# Altium schematic sheet Sheet1.SchDoc: STM32F10C8T6
size A4; DrawnBy: Joseph; SheetNumber: 1; SheetTotal: 1
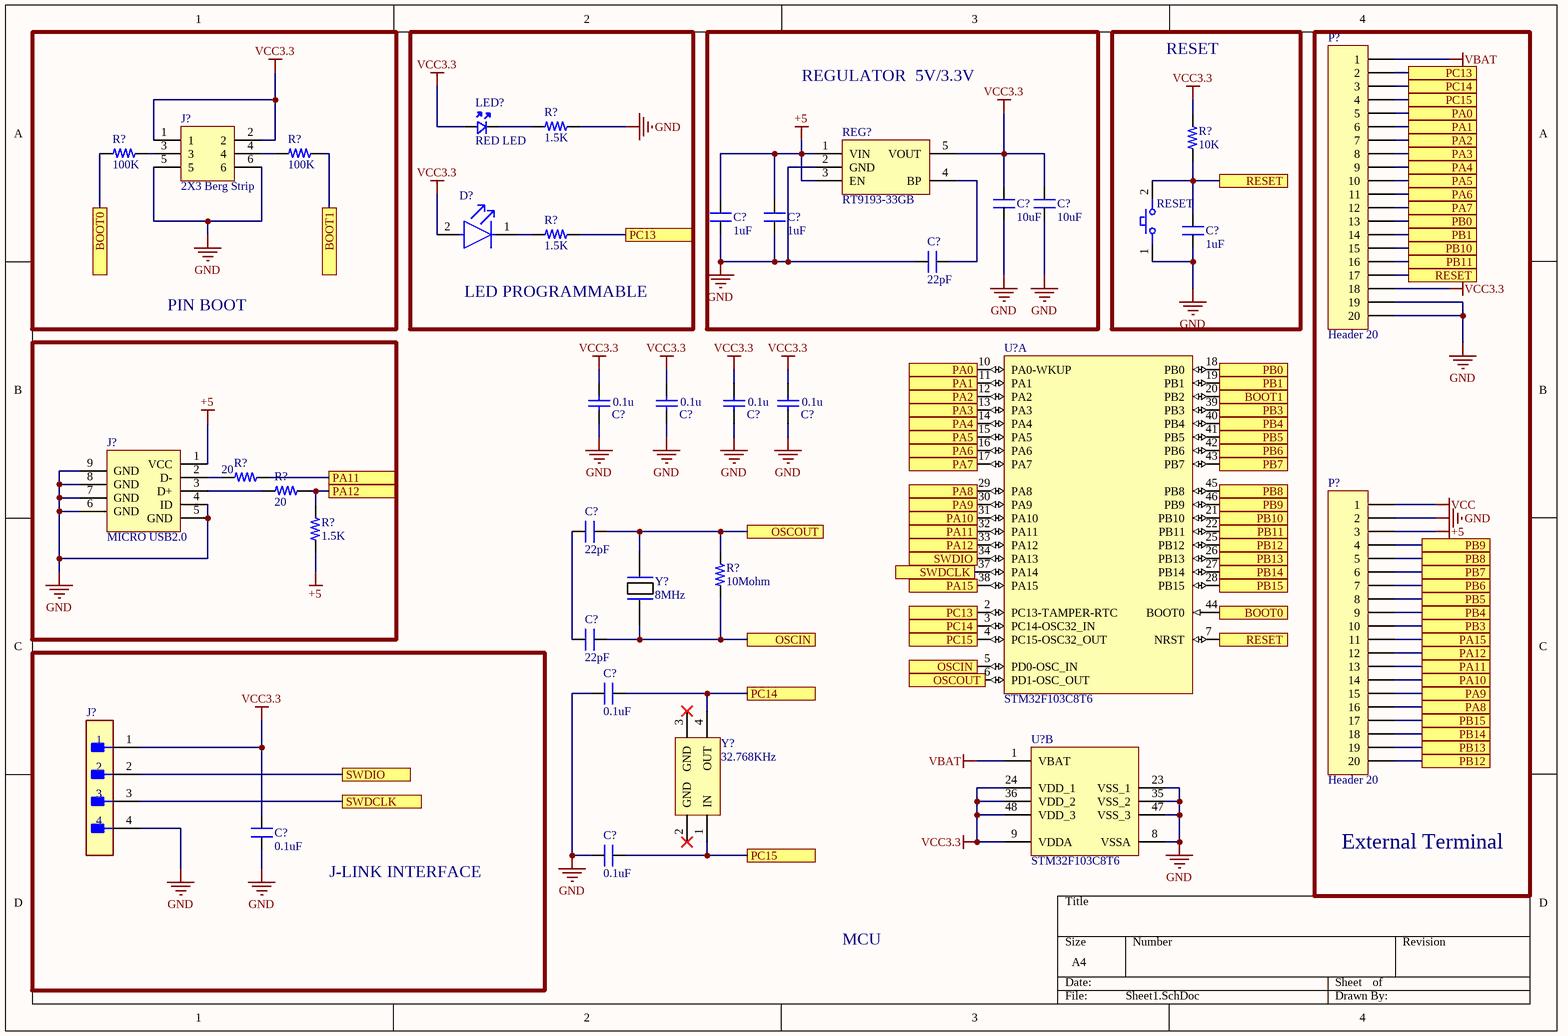
[diagram p0: Sheet1.SchDoc]

## Parts
(Parts that share a designator on the sheet are numbered #1, #2 ... from top to bottom, then left to right.)
C?#1  10uF  [CAP_0805]
C?#2  10uF  [CAP_0805]
C?#3  1uF  [CAP_0805]
C?#4  1uF  [CAP_0805]
C?#5  1uF  [CAP_0805]
C?#6  22pF  [CAP_0805]
C?#7  0.1u  [CAPC0402(1005)60_L]
C?#8  0.1u  [CAPC0402(1005)60_L]
C?#9  0.1u  [CAPC0402(1005)60_L]
C?#10  0.1u  [CAPC0402(1005)60_L]
C?#11  22pF  [CAP_0805]
C?#12  22pF  [CAP_0805]
C?#13  0.1uF  [CAP_0805]
C?#14  0.1uF  [CAP_0805]
C?#15  0.1uF  [CAP_0805]
D?  LED BLUE  [FP-APHCM2012QBC-D-F01-MFG]  (value not drawn)
J?#1  2X3 Berg Strip  [CON6_100_59D78_TH_ST_Duplicate]
J?#2  MICRO USB2.0  [CON_10118192-0001LF_SMD]
J?#3  TMM-104-01-L-S-RA  [FP-TMM-104-01-L-S-RA-MFG]  (value not drawn)
LED?  RED LED  [LED_0805]
P?#1  Header 20  [HDR1X20]
P?#2  Header 20  [HDR1X20]
R?#1  1.5K  [RES_0805]
R?#2  10K  [RES_0805]
R?#3  100K  [RES_0805]
R?#4  100K  [RES_0805]
R?#5  1.5K  [RES_0805]
R?#6  20  [RES_0805]
R?#7  20  [RES_0805]
R?#8  1.5K  [RES_0805]
R?#9  10Mohm  [RES_0805]
REG?  RT9193-33GB  [SOT23-5]
RESET  SKSTAAE010  [FP-SKSTAAE010-MFG]  (value not drawn)
U?#1  STM32F103C8T6  [STM-LQFP48_L]  (part A of 2)
U?#2  STM32F103C8T6  [STM-LQFP48_L]  (part B of 2)
Y?#1  8MHz  [XTAL_314_240X47_SMD]
Y?#2  32.768KHz  [XTAL_MC-405 32.7680K-G3]

## Blocks framed on the sheet
PIN BOOT: J?#1 R?#3 R?#4
LED PROGRAMMABLE: D? LED? R?#1 R?#5
REGULATOR  5V/3.3V: C?#1-C?#4 C?#6 REG?
RESET: C?#5 R?#2 RESET
External Terminal: P?#1 P?#2
J-LINK INTERFACE: C?#14 J?#3

## Ports
BOOT0 (see Sheet1[1B]), BOOT0 (see Sheet1[4C]), BOOT1 (see Sheet1[1B]), BOOT1 (see Sheet1[4B]), OSCIN (see Sheet1[2C]), OSCIN (see Sheet1[3C]), OSCOUT (see Sheet1[2C]), OSCOUT (see Sheet1[3C]), PA0 (see Sheet1[3B]), PA0 (see Sheet1[4A]), PA1 (see Sheet1[3B]), PA1 (see Sheet1[4A]), PA2 (see Sheet1[3B]), PA2 (see Sheet1[4A]), PA3 (see Sheet1[3B]), PA3 (see Sheet1[4A]), PA4 (see Sheet1[3B]), PA4 (see Sheet1[4A]), PA5 (see Sheet1[3B]), PA5 (see Sheet1[4A]), PA6 (see Sheet1[3B]), PA6 (see Sheet1[4A]), PA7 (see Sheet1[3B]), PA7 (see Sheet1[4A]), PA8 (see Sheet1[3B]), PA8 (see Sheet1[4C]), PA9 (see Sheet1[3B]), PA9 (see Sheet1[4C]), PA10 (see Sheet1[3C]), PA10 (see Sheet1[4C]), PA11 (see Sheet1[1B], Sheet1[3C]), PA11 (see Sheet1[1B], Sheet1[4C]), PA11 (see Sheet1[3C], Sheet1[4C]), PA12 (see Sheet1[1B], Sheet1[3C]), PA12 (see Sheet1[1B], Sheet1[4C]), PA12 (see Sheet1[3C], Sheet1[4C]), PA15 (see Sheet1[3C]), PA15 (see Sheet1[4C]), PB0 (see Sheet1[4A]), PB0 (see Sheet1[4B]), PB1 (see Sheet1[4A]), PB1 (see Sheet1[4B]), PB3 (see Sheet1[4B]), PB3 (see Sheet1[4C]), PB4 (see Sheet1[4B]), PB4 (see Sheet1[4C]), PB5 (see Sheet1[4B]), PB5 (see Sheet1[4C]), PB6 (see Sheet1[4B]), PB6 (see Sheet1[4C]), PB7 (see Sheet1[4B]), PB7 (see Sheet1[4C]), PB8 (see Sheet1[4B]), PB8 (see Sheet1[4C]), PB9 (see Sheet1[4B]), PB9 (see Sheet1[4C]), PB10 (see Sheet1[4A]), PB10 (see Sheet1[4C]), PB11 (see Sheet1[4B]), PB11 (see Sheet1[4C]), PB12 (see Sheet1[4C]), PB13 (see Sheet1[4C]), PB14 (see Sheet1[4C]), PB15 (see Sheet1[4C]), PC13 (see Sheet1[2A], Sheet1[3C]), PC13 (see Sheet1[2A], Sheet1[4A]), PC13 (see Sheet1[3C], Sheet1[4A]), PC14 (see Sheet1[2C], Sheet1[3C]), PC14 (see Sheet1[2C], Sheet1[4A]), PC14 (see Sheet1[3C], Sheet1[4A]), PC15 (see Sheet1[2D], Sheet1[3C]), PC15 (see Sheet1[2D], Sheet1[4A]), PC15 (see Sheet1[3C], Sheet1[4A]), RESET (see Sheet1[4A], Sheet1[4B]), RESET (see Sheet1[4A], Sheet1[4C]), RESET (see Sheet1[4B], Sheet1[4C]), SWDCLK (see Sheet1[1D]), SWDCLK (see Sheet1[3C]), SWDIO (see Sheet1[1D]), SWDIO (see Sheet1[3C])

## Nets
+5: C?#3.2 C?#4.2 J?#2.1(VCC) P?#2.3 R?#8.1 REG?.1(VIN) REG?.3(EN)
GND: C?#1.1 C?#2.1 C?#3.1 C?#4.1 C?#5.1 C?#6.1 C?#7.1 C?#8.1 C?#9.1 C?#10.1 C?#13.1 C?#14.1 C?#15.1 J?#1.5 J?#1.6 J?#2.4(ID) J?#2.5(GND) J?#2.6(GND) J?#2.7(GND) J?#2.8(GND) J?#2.9(GND) J?#3.4 P?#1.19 P?#1.20 P?#2.2 R?#1.2 REG?.2(GND) RESET.1 U?#2.8(VSSA) U?#2.23(VSS_1) U?#2.35(VSS_2) U?#2.47(VSS_3)
VBAT: P?#1.1 U?#2.1(VBAT)
VCC: P?#2.1
VCC3.3: C?#1.2 C?#2.2 C?#7.2 C?#8.2 C?#9.2 C?#10.2 C?#14.2 D?.2(A) J?#1.1 J?#1.2 J?#3.1 LED?.A P?#1.18 R?#2.2 REG?.5(VOUT) U?#2.9(VDDA) U?#2.24(VDD_1) U?#2.36(VDD_2) U?#2.48(VDD_3)
BOOT0: R?#3.1 U?#1.44(BOOT0) ; port BOOT0
BOOT1: R?#4.2 U?#1.20(PB2) ; port BOOT1
OSCIN: C?#12.2 R?#9.1 U?#1.5(PD0-OSC_IN) Y?#1.1 ; port OSCIN
OSCOUT: C?#11.2 R?#9.2 Y?#1.2 ; port OSCOUT
PA0: P?#1.5 U?#1.10(PA0-WKUP) ; port PA0
PA1: P?#1.6 U?#1.11(PA1) ; port PA1
PA2: P?#1.7 U?#1.12(PA2) ; port PA2
PA3: P?#1.8 U?#1.13(PA3) ; port PA3
PA4: P?#1.9 U?#1.14(PA4) ; port PA4
PA5: P?#1.10 U?#1.15(PA5) ; port PA5
PA6: P?#1.11 U?#1.16(PA6) ; port PA6
PA7: P?#1.12 U?#1.17(PA7) ; port PA7
PA8: P?#2.16 U?#1.29(PA8) ; port PA8
PA9: P?#2.15 U?#1.30(PA9) ; port PA9
PA10: P?#2.14 U?#1.31(PA10) ; port PA10
PA11: P?#2.13 R?#6.2 U?#1.32(PA11) ; port PA11
PA12: P?#2.12 R?#7.2 R?#8.2 U?#1.33(PA12) ; port PA12
PA15: P?#2.11 U?#1.38(PA15) ; port PA15
PB0: P?#1.13 U?#1.18(PB0) ; port PB0
PB1: P?#1.14 U?#1.19(PB1) ; port PB1
PB3: P?#2.10 U?#1.39(PB3) ; port PB3
PB4: P?#2.9 U?#1.40(PB4) ; port PB4
PB5: P?#2.8 U?#1.41(PB5) ; port PB5
PB6: P?#2.7 U?#1.42(PB6) ; port PB6
PB7: P?#2.6 U?#1.43(PB7) ; port PB7
PB8: P?#2.5 U?#1.45(PB8) ; port PB8
PB9: P?#2.4 U?#1.46(PB9) ; port PB9
PB10: P?#1.15 U?#1.21(PB10) ; port PB10
PB11: P?#1.16 U?#1.22(PB11) ; port PB11
PB12: P?#2.20 U?#1.25(PB12) ; port PB12
PB13: P?#2.19 U?#1.26(PB13) ; port PB13
PB14: P?#2.18 U?#1.27(PB14) ; port PB14
PB15: P?#2.17 U?#1.28(PB15) ; port PB15
PC13: P?#1.2 R?#5.2 U?#1.2(PC13-TAMPER-RTC) ; port PC13
PC14: C?#13.2 P?#1.3 U?#1.3(PC14-OSC32_IN) Y?#2.4(OUT) ; port PC14
PC15: C?#15.2 P?#1.4 U?#1.4(PC15-OSC32_OUT) Y?#2.1(IN) ; port PC15
RESET: C?#5.2 P?#1.17 R?#2.1 RESET.2 U?#1.7(NRST) ; port RESET
SWDCLK: J?#3.3 U?#1.37(PA14) ; port SWDCLK
SWDIO: J?#3.2 U?#1.34(PA13) ; port SWDIO
NetC?#6_2: C?#6.2 REG?.4(BP)
NetC?#11_1: C?#11.1 C?#12.1
NetD?_1: D?.1(C) R?#5.1
NetJ?#1_3: J?#1.3 R?#3.2
NetJ?#1_4: J?#1.4 R?#4.1
NetJ?#2_2: J?#2.2(D-) R?#6.1
NetJ?#2_3: J?#2.3(D+) R?#7.1
NetLED?_K: LED?.K R?#1.1

Not connected (* = marked no-connect by the designer): U?#1 6(PD1-OSC_OUT); Y?#2 2(GND)* 3(GND)*

## Notes on the sheet
- MCU

## Library data of the parts
C?#1-C?#5 = CAP_1uF-50V-5%-0805: 1µF ±5% 50V Ceramic Capacitor X7R 0805 (2012 Metric); Manufacturer: Yageo; Manufacturing Part Number: CC0805JKX7R9BB105; Case/Package: 0805 (2012 Metric); Supplier-1: Digikey; Supplier Part Number-1: 311-3498-1-ND
C?#6 C?#11 C?#12 = CAP_22pF-50V-5%-0805: 22pF ±5% 50V Ceramic Capacitor C0G, NP0 0805 (2012 Metric); Manufacturer: KEMET; Manufacturer Part Number: C0805C220J5GACTU; Case/Package: 0805; Supplier-1: Digikey; Supplier Part Number-1: 399-1113-1-ND
C?#7-C?#10 = CMP-1034-02112-1: CAP 1uF 4V ±20% 0402 (1005 Metric) Thickness 0.6mm SMD; Case-Metric: 1005; Case-EIA: 0402; Tolerance: Â±20%; Value: 0.1u; Technology: SMT; Max Thickness: 0.6 mm; Rated Voltage: 4 V
C?#13-C?#15 = CAP_0.1uF-50V-5%-0805: 0.1µF ±5% 50V Ceramic Capacitor X7R 0805 (2012 Metric); Manufacturer: KEMET; Manufacturing Part Number: C0805C104J5RACTU; Case/Package: 0805 (2012 Metric); Supplier-1: Digikey; Supplier Part Number-1: 399-1171-1-ND
D? = CMP-44529-000061-1: LED BLUE CLEAR CHIP SMD; Forward Current: 20mA; Viewing Angle: 110°; Dominant Wavelength: 465nm; Luminous Intensity: 100mcd; Number of LEDs: 1; Forward Voltage: 3.3V; Lens Color: Colorless; Packaging: Tape and Reel; Color: Blue; Length: 2mm; Case Code (Metric): 2012; Case Code (Imperial): 0805; Illumination Color: Blue; Width: 1.25mm; Mount: Surface Mount; Series: -; Height: 0.4mm; Case/Package: 0805; Package Quantity: 2000; Test Current: 20mA; Lead Free: Lead Free; Number of Pins: 2; Min Operating Temperature: -40°C; Lens Transparency: Clear; Lens Style: Clear; RoHS Compliant: Yes; Max Operating Temperature: 85°C
J?#1 = CON-BS-PLG_2X3-100-TH-ST: 6 pin, 2 row, 2.54mm pitch bergstrip; Manufacturer: NA; Manufacturer Part Number: NA; Case/Package: TH; Supplier-1: NA; Supplier Part Number-1: NA
J?#2 = CON-USB_10118192-0002LF-SMD: USB - micro B USB 2.0 Receptacle Connector 5 Position Surface Mount, Right Angle; Manufacturer: Amphenol ICC (FCI); Manufacturing Part Number: 10118192-0002LF; Case/Package: SMD; Supplier-1: Digikey; Supplier Part Number-1: 609-5379-1-ND
J?#3 = CMP-02766-001710-1: CONN HEADER R/A 4POS 2MM; Number of Contacts: 4; Max Voltage Rating (AC): 500V; Max Current Rating: 3.9A; Gender: Male; Housing Color: Black; Termination: Solder; Max Operating Temperature: 125°C; Packaging: Bulk; Lead Free: Lead Free; Min Operating Temperature: -55°C; Number of Rows: 1; Length: 8mm; REACH SVHC: No SVHC; Housing Material: Polymer; Orientation: Right Angle; RoHS Compliant: Yes; Radiation Hardening: No; Depth: 5.97mm; Pitch: 2mm; Contact Plating: Gold; Contact Material: Bronze
LED? = LED-RED_10mA-0805: Red 621nm LED Indication - Discrete 2V 0805 (2012 Metric); Manufacturer: Lite-On Inc.; Manufacturer Part Number: LTST-C170EKT; Case/ Package: 0805; Supplier-1: Digikey; Supplier Part Number-1: 160-1178-1-ND
P?#1 P?#2 = Header 20: Header, 20-Pin; LatestRevisionDate: 17-Jul-2002; LatestRevisionNote: Re-released for DXP Platform.; Publisher: Altium Limited
R?#1 R?#5-R?#8 = RES_1.5K-0.125W-1%-0805: 1.5 kOhms ±1% 0.125W, 1/8W Chip Resistor 0805 (2012 Metric) Thick Film; Manufacturer: TE Connectivity Passive Product; Manufacturing Part Number: CRG0805F1K5; Case/Package: 0805; Supplier-1: Digikey; Supplier Part Number-1: A106057CT-ND
R?#2-R?#4 = RES_10K-0.125W-1%-0805: 10 kOhms ±1% 0.125W, 1/8W Chip Resistor 0805 (2012 Metric) Moisture Resistant Thick Film; Manufacturer: Yageo; Manufacturing Part Number: RC0805FR-0710KL; Case/Package: 0805; Supplier-1: Digikey; Supplier Part Number-1: 311-10.0KCRCT-ND
R?#9 = RES_10MOHM-0.125W-1%-0805: 10 MOhms ±1% 0.125W, 1/8W Chip Resistor 0805 (2012 Metric) Automotive AEC-Q200, High Voltage Thick Film; Manufacturer: Rohm Semiconductor; Manufacturing Part Number: KTR10EZPF1005; Case/Package: 0805 (2012 Metric); Supplier-1: Digikey; Supplier Part Number-1: RHM10.0MAHCT-ND
REG? = REG_3.3V-5.5V-0.3A-SOT-23-5: Linear Voltage Regulator IC 1 Output 300mA SOT-23-5; Manufacturer: Richtek USA Inc.; Manufacturer Part Number: RT9193-33GB; Case/ Package: SOT-23-5; Supplier-1: Digikey; Supplier Part Number-1: 1028-1014-1-ND
RESET = CMP-24311-000002-1: Tactile Switches Quiet 0.9mm Middle Stroke, 4N,500KCycle; Lead Free: Lead Free
U?#1 U?#2 = CMP-0237-00215-3: ARM Cortex-M3 32-bit MCU, 64 KB Flash, 20 KB Internal RAM, 37 I/Os, 48-pin LQFP, -40 to 85 degC, Tray; Supply Voltage(Vcc) min (V): 2; Internal RAM Size (kB): 20; FLASH Size (Prog) (kB): 64; A/D Converter: 2x12-bit (10 Channel); I/Os (High Current): 37; Operating Frequency(F) (Processor speed) (MHz): 72; Core: ARM Cortex-M3; ComponentLink3Description: Package Specification; Mounting Technology: Surface Mount; PartNumber: STM32F103C8T6; PackageReference: LQFP48; Packing: Tray; ComponentLink3URL: http://www.st.com/st-web-ui/static/active/en/resource/technical/document/datasheet/DM00058181.pdf; DatasheetVersion: Rev. 16; ComponentLink1URL: http://www.st.com/web/en/home.html; PackageVersion: Rev. 6, 06/2013; ComponentLink2URL: http://www.st.com/st-web-ui/static/active/en/resource/technical/document/datasheet/CD00161566.pdf; ComponentLink1Description: Manufacturer URL; ComponentLink2Description: Datasheet; PackageDescription: 48-Pin Low Profile Quad Flat Package, 7 x 7 mm Body, 0.5 mm Pitch
Y?#1 = XTAL_8MHZ-LFXTAL030234: Crystals 8MHz 22pF -20C 70C; Manufacturer: IQD Frequency Products; Manufacturing Part Number: LFXTAL030234Reel; Case/Package: SMD; Supplier-1: Mouser; Supplier Part Number-1: 449-LFXTAL030234REEL
Y?#2 = XTAL_32.768KHz-MC-405 32.7680K-G3: Crystals SMD AT XTL MHZ +/-50PPM 12.5 PF 250 T/R; Manufacturer: Epson; Manufacturing Part Number: MC-405 32.7680K-G3: ROHS; Case/Package: SMD; Supplier-1: Mouser; Supplier Part Number-1: 732-MC405327680KG3RS